# EAGLE design Z - Carrier - 32 Pin (EAGLE 7.6.0)
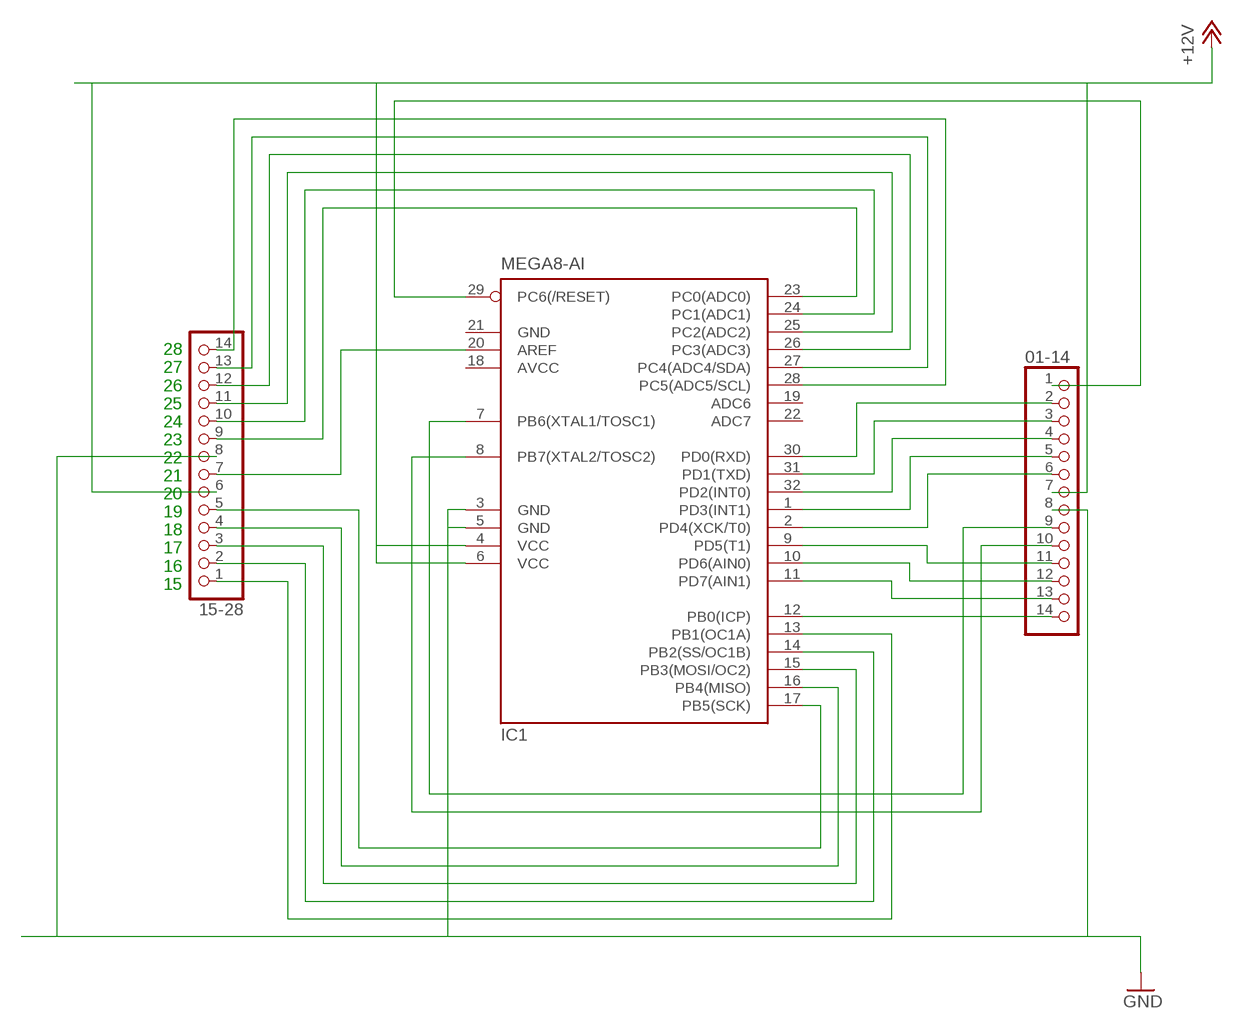
[diagram p0: schematic, sheet 1]

## Parts
01-14  PINHD-1X14  [1X14]
15-28  PINHD-1X14  [1X14]
IC1  MEGA8-AI  [TQFP32-08]

## Nets
1: 01-14.1 IC1.29(PC6(/RESET))
14: 01-14.14 IC1.12(PB0(ICP))
15: 15-28.1 IC1.13(PB1(OC1A))
28: 15-28.14 IC1.28(PC5(ADC5/SCL))
+12V: 01-14.7 15-28.6 IC1.4(VCC) IC1.6(VCC)
GND: 01-14.8 15-28.8 IC1.3(GND) IC1.5(GND)
N$3: 01-14.2 IC1.30(PD0(RXD))
N$4: 01-14.3 IC1.31(PD1(TXD))
N$5: 01-14.4 IC1.32(PD2(INT0))
N$6: 01-14.5 IC1.1(PD3(INT1))
N$7: 01-14.6 IC1.2(PD4(XCK/T0))
N$8: 01-14.9 IC1.7(PB6(XTAL1/TOSC1))
N$9: 01-14.10 IC1.8(PB7(XTAL2/TOSC2))
N$10: 01-14.11 IC1.9(PD5(T1))
N$11: 01-14.12 IC1.10(PD6(AIN0))
N$12: 01-14.13 IC1.11(PD7(AIN1))
N$15: 15-28.2 IC1.14(PB2(SS/OC1B))
N$16: 15-28.3 IC1.15(PB3(MOSI/OC2))
N$17: 15-28.4 IC1.16(PB4(MISO))
N$18: 15-28.5 IC1.17(PB5(SCK))
N$19: 15-28.7 IC1.20(AREF)
N$21: 15-28.9 IC1.23(PC0(ADC0))
N$22: 15-28.10 IC1.24(PC1(ADC1))
N$23: 15-28.11 IC1.25(PC2(ADC2))
N$24: 15-28.12 IC1.26(PC3(ADC3))
N$25: 15-28.13 IC1.27(PC4(ADC4/SDA))
Unconnected: IC1.19(ADC6) IC1.22(ADC7)

## Notes on the sheet
- 28
  27
  26
  25
  24
  23
  22
  21
  20
  19
  18
  17
  16
  15

## Power pins joined to a net without a drawn wire
AVCC: IC1.18(AVCC)
GND: IC1.21(GND)

## Library data of the parts
01-14 15-28 = pinhead:PINHD-1X14: PIN HEADER
IC1 = atmel:MEGA8: MICROCONTROLLER 8 Kbytes FLASH, 1 kbytes SRAM, 512 bytes EEPROM, USART, 6-channel 10 bit ADC, 2-channel 8 bit ADC Pin compatible with Atmega48, ATMega88, ATMega168 Source: avr.lbr; MPN: ATMEGA8-16AU; OC_FARNELL: 9171371; OC_NEWARK: 73M8863

## Board
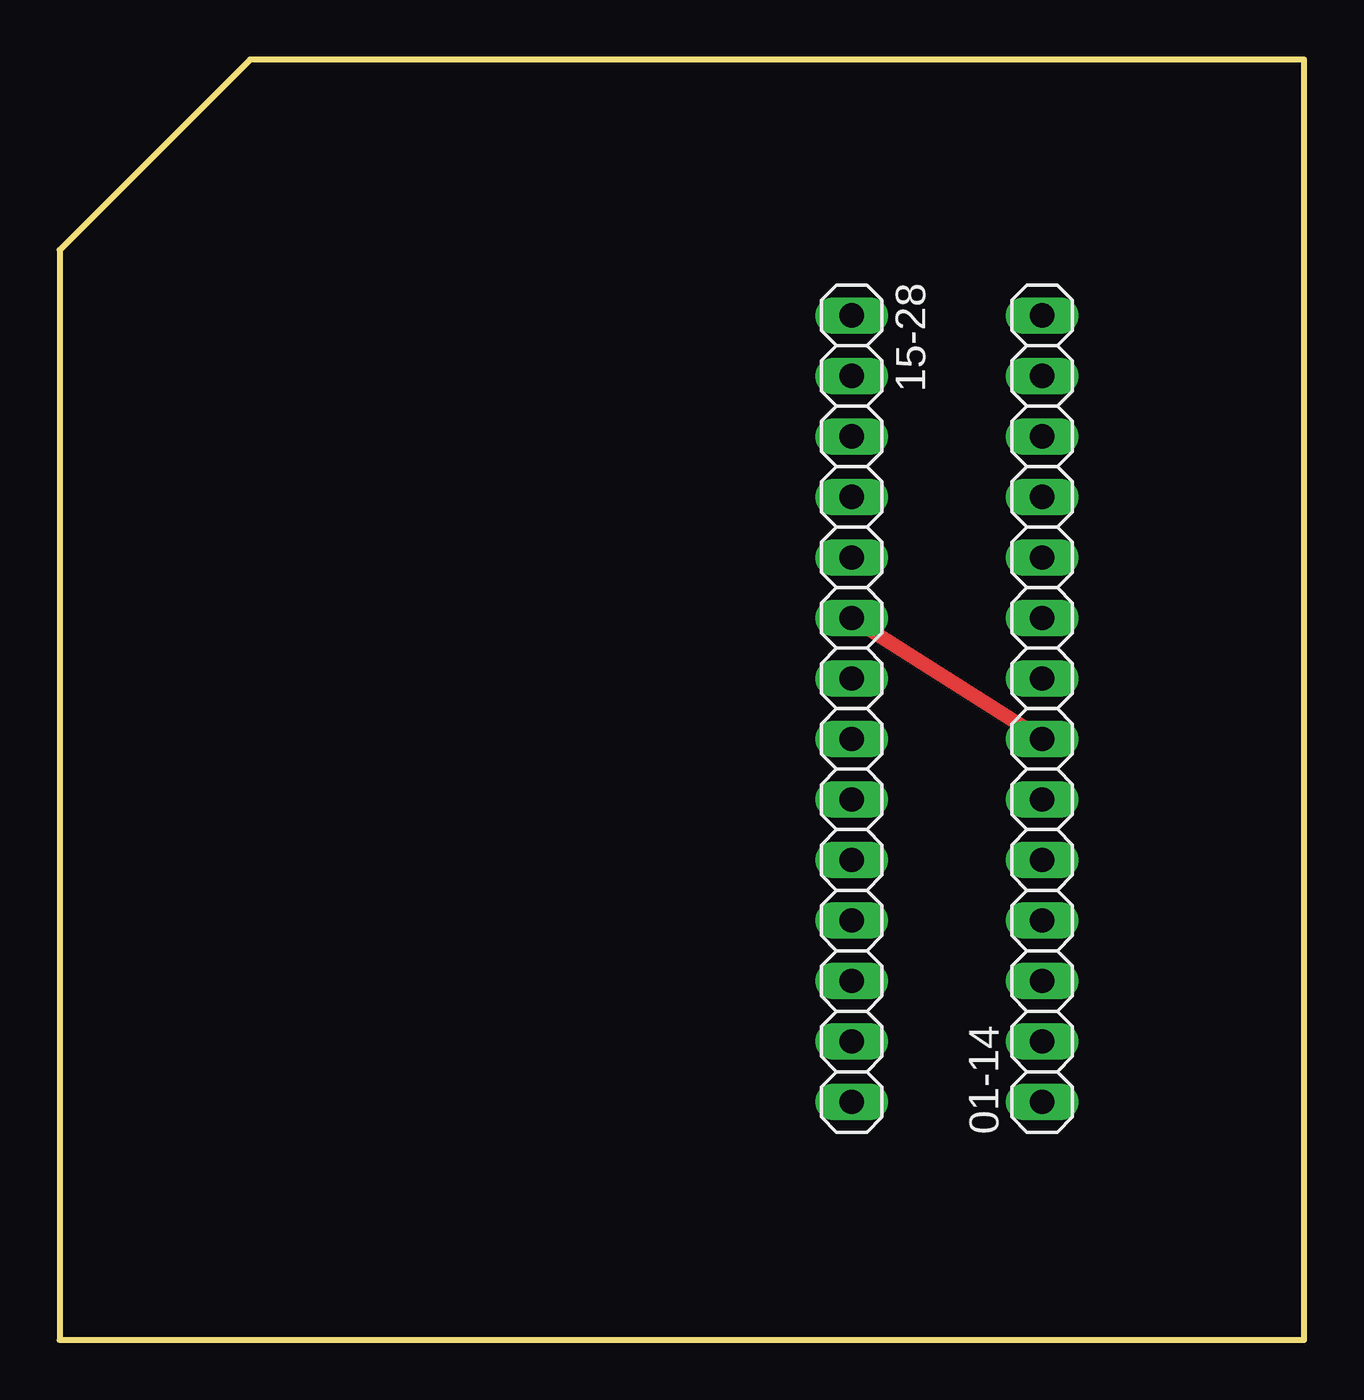
[diagram p1: board, top side]
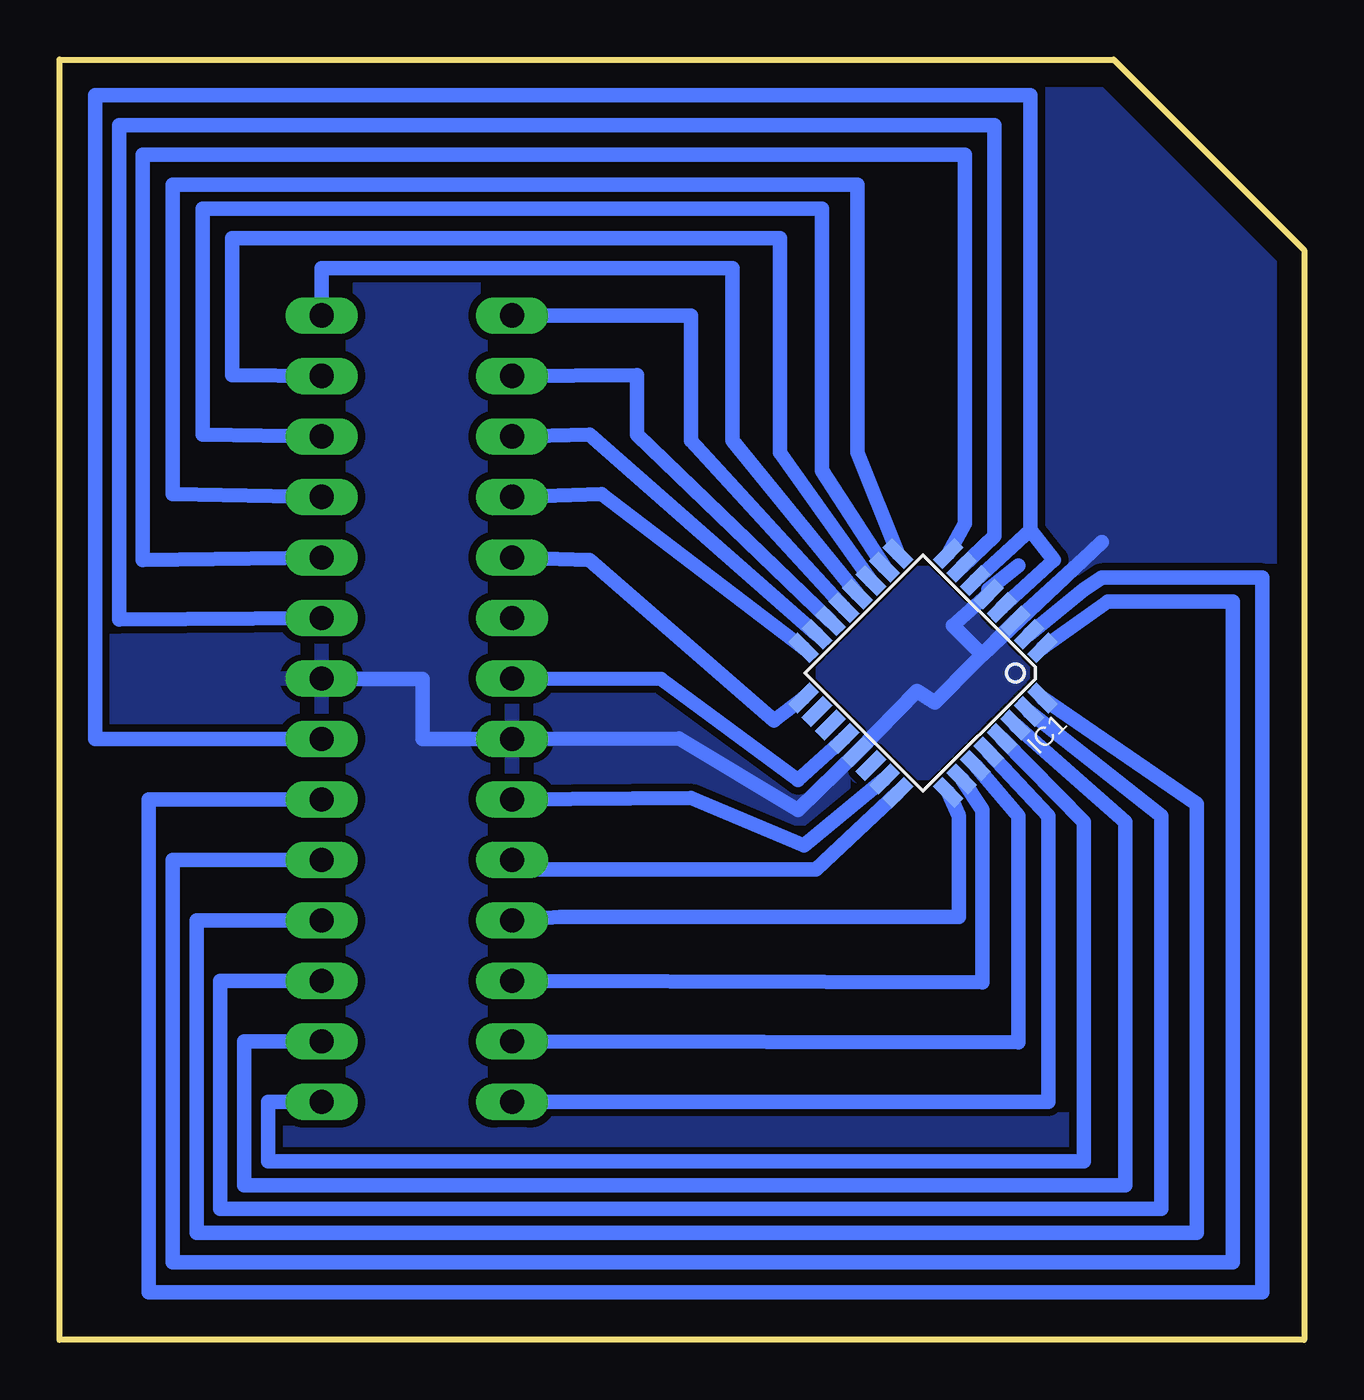
[diagram p2: board, bottom side, seen from below]

Size 52.25 x 53.75 mm. Coordinates in mm from the lower left corner, seen from the top.
Outline: 8,53.75 0,45.75 0,0 52.25,0 52.25,53.75 8,53.75
Copper layers (1*16): Top 0.035mm / dielectric 1.5mm / Bottom 0.035mm
Design rules "default *": minimum track width 10mil, minimum drill 24mil, track to track 12mil, track to pad 12mil, pad to pad 12mil, via to via 12mil, smd to smd 8mil, copper to edge 40mil, drill to drill 12mil, minimum pad ring 10mil, minimum via ring 8mil, stop-mask expansion 4mil, vias tented up to drill 0mil, thermal gap 10mil

### Footprints (pad centres in the part's own frame; a part is rotated, then mirrored left to right if it is on the bottom)
1X14 = drill 1.016 long: 1 -16.51,0; 2 -13.97,0; 3 -11.43,0; 4 -8.89,0; 5 -6.35,0; 6 -3.81,0; 7 -1.27,0; 8 1.27,0; 9 3.81,0; 10 6.35,0; 11 8.89,0; 12 11.43,0; 13 13.97,0; 14 16.51,0
TQFP32-08 = smd 1.27 x 0.559: 1 -4.293,2.8; 2 -4.293,2; 3 -4.293,1.2; 4 -4.293,0.4; 5 -4.293,-0.4; 6 -4.293,-1.2; 7 -4.293,-2; 8 -4.293,-2.8; 17 4.293,-2.8; 18 4.293,-2; 19 4.293,-1.2; 20 4.293,-0.4; 21 4.293,0.4; 22 4.293,1.2; 23 4.293,2; 24 4.293,2.8 | smd 0.559 x 1.27: 9 -2.8,-4.293; 10 -2,-4.293; 11 -1.2,-4.293; 12 -0.4,-4.293; 13 0.4,-4.293; 14 1.2,-4.293; 15 2,-4.293; 16 2.8,-4.293; 25 2.8,4.293; 26 2,4.293; 27 1.2,4.293; 28 0.4,4.293; 29 -0.4,4.293; 30 -1.2,4.293; 31 -2,4.293; 32 -2.8,4.293

### Placement (x,y rotation side)
01-14  41.25,26.5 90 top
15-28  33.25,26.5 270 top
IC1  16,28 225 bottom

### Tracks (layer width: path | path; a pad name or v marks a point on that pad's centre or on a via)
1
  Bottom 0.61: 01-14.1 43.5,9.99 43.5,7.5 9.25,7.5 9.25,21.75 IC1.29
14
  Bottom 0.61: IC1.12 24,37.75 24,45 41.25,45 01-14.14
15
  Bottom 0.61: IC1.13 25.75,37.75 25.75,43 15-28.1
28
  Bottom 0.61: IC1.28 10.75,22 10.75,10 15-28.14
+12V
  Top 0.61: 01-14.7 15-28.6
  Bottom 0.61: IC1.4 10.5,32.75 11.5,34 | 11.5,34 IC1.6 | 01-14.7 50.75,25.23 50.75,52.25 11.5,52.25 11.5,34
GND
  Bottom 0.61: IC1.5 14.75,30 13.5,28.75 8.5,33.5 IC1.3 15.5,26.75 16.25,27.25 IC1.21 21.25,22.25 26.25,25.25 15-28.8 37,25.23 37,27.75 41.25,27.75 01-14.8
  pour Bottom: 0.25,46 8.25,53.75 52.25,53.75 52.25,0 0,0 0,45.75
N$1
  Bottom 0.61: 13.25,31.5 12,32.5
N$3
  Bottom 0.61: 01-14.2 44.5,12.53 44.5,6.5 7.5,6.5 7.5,21.75 IC1.30
N$4
  Bottom 0.61: 01-14.3 45.5,15.07 45.5,5.5 6,5.5 6,22 IC1.31
N$5
  Bottom 0.61: 01-14.4 46.5,17.61 46.5,4.5 4.5,4.5 4.5,22.5 IC1.32
N$6
  Bottom 0.61: 01-14.5 47.5,20.15 47.5,3.25 3,3.25 3,31 8.25,31 IC1.1
N$7
  Bottom 0.61: 01-14.6 48.5,22.69 48.5,2 1.75,2 1.75,32 8.5,32 9.25,31.5 IC1.2
N$8
  Bottom 0.61: IC1.7 13,33.75 13,51 49.75,51 49.75,30.25 01-14.9
N$9
  Bottom 0.61: IC1.8 14.25,34.27 14.25,49.75 48.75,49.75 48.75,32.75 01-14.10
N$10
  Bottom 0.61: IC1.9 18.75,37.25 18.75,48.5 47.5,48.5 47.5,35.5 01-14.11
N$11
  Bottom 0.61: IC1.10 20.25,36.5 20.25,47.5 46.25,47.5 46.25,38 01-14.12
N$12
  Bottom 0.61: IC1.11 22,37.25 22,46.25 45,46.25 45,40.5 01-14.13
N$15
  Bottom 0.61: IC1.14 28,38 28,40.5 15-28.2
N$16
  Bottom 0.61: IC1.15 30,38 15-28.3
N$17
  Bottom 0.61: IC1.16 29.5,35.5 15-28.4
N$18
  Bottom 0.61: IC1.17 22.25,26 30,32.75 15-28.5
N$19
  Bottom 0.61: IC1.20 21.25,23.5 27,27.75 15-28.7
N$21
  Bottom 0.61: IC1.23 21,20.75 25.75,22.75 15-28.9
N$22
  Bottom 0.61: IC1.24 20.5,19.75 33.5,19.75 15-28.10
N$23
  Bottom 0.61: IC1.25 14.5,22 14.5,17.75 31.25,17.75 15-28.11
N$24
  Bottom 0.61: IC1.26 13.5,22.25 13.5,15 15-28.12
N$25
  Bottom 0.61: IC1.27 12,22 12,12.5 15-28.13